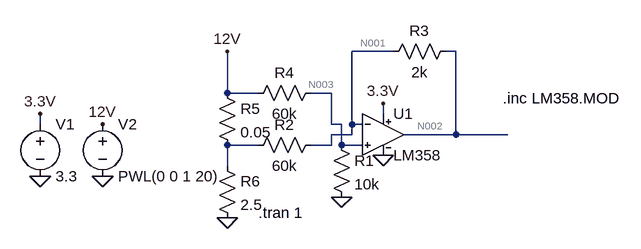
[diagram p0: schematic CurrentSense.asc]
CurrentSense.asc, the LTspice schematic file:
Version 4
SHEET 1 880 680
WIRE 240 48 176 48
WIRE 336 48 320 48
WIRE -16 112 -16 48
WIRE 32 112 -16 112
WIRE 144 112 112 112
WIRE 224 144 224 128
WIRE -304 160 -304 144
WIRE 144 160 144 112
WIRE 160 160 144 160
WIRE 176 160 176 48
WIRE 192 160 176 160
WIRE 176 176 176 160
WIRE 176 176 144 176
WIRE 336 176 336 48
WIRE 336 176 256 176
WIRE 416 176 336 176
WIRE 32 192 -16 192
WIRE 144 192 144 176
WIRE 144 192 112 192
WIRE 160 192 160 160
WIRE 192 192 160 192
WIRE -16 224 -16 192
FLAG 224 208 0
FLAG -304 240 0
FLAG 224 128 3.3V
FLAG -304 144 3.3V
FLAG -16 304 0
FLAG -208 240 0
FLAG -208 160 12V
FLAG -16 48 12V
FLAG 160 272 0
SYMBOL res 336 32 R90
WINDOW 0 0 56 VBottom 2
WINDOW 3 32 56 VTop 2
SYMATTR InstName R3
SYMATTR Value 2k
SYMBOL LM358\\LM358 224 112 R0
SYMATTR InstName U1
SYMBOL voltage -304 144 R0
WINDOW 123 0 0 Left 2
WINDOW 39 0 0 Left 2
SYMATTR InstName V1
SYMATTR Value 3.3
SYMBOL res 128 96 R90
WINDOW 0 0 56 VBottom 2
WINDOW 3 32 56 VTop 2
SYMATTR InstName R4
SYMATTR Value 60k
SYMBOL res -32 96 R0
SYMATTR InstName R5
SYMATTR Value 0.05
SYMBOL res -32 208 R0
SYMATTR InstName R6
SYMATTR Value 2.5
SYMBOL voltage -208 144 R0
WINDOW 123 0 0 Left 2
WINDOW 39 0 0 Left 2
SYMATTR InstName V2
SYMATTR Value PWL(0 0 1 20)
SYMBOL res 144 176 R0
SYMATTR InstName R1
SYMATTR Value 10k
SYMBOL res 128 176 R90
WINDOW 0 0 56 VBottom 2
WINDOW 3 32 56 VTop 2
SYMATTR InstName R2
SYMATTR Value 60k
TEXT 32 296 Left 2 !.tran 1
TEXT 408 120 Left 2 !.inc LM358.MOD

The netlist it stands for:
* CurrentSense.asc
R3 N002 N001 2k
XU1 N001 N003 N002 3.3V 0 LM358  ; pins In- In+ OUT V+ V-
V1 3.3V 0 3.3
R4 N003 12V 60k
R5 12V N004 0.05
R6 N004 0 2.5
V2 12V 0 PWL(0 0 1 20)
R1 N003 0 10k
R2 N001 N004 60k
.tran 1
.inc LM358.MOD
.lib LM358.MOD
.backanno
.end

* Results of the author's LTspice run, read from the files saved beside the schematic
* Operating Point, zero values left out:
*   V(n002) = 2.127 mV
*   V(n001) = 2.071 mV
*   V(n003) = 59.65 µV
*   V(3.3v) = 3.3 V
*   I(R2) = 34.51 nA
*   I(R1) = 5.965 nA
*   I(R6) = 676.7 pA
*   I(R5) = -33.83 nA
*   I(R4) = 994.1 pA
*   I(R3) = 27.97 nA
*   I(V2) = 34.83 nA
*   I(V1) = -230.4 µA
*   Ix(u1:1) = -6.543 nA
*   Ix(u1:2) = -6.959 nA
*   Ix(u1:3) = -27.97 nA
*   Ix(u1:4) = 230.4 µA
*   Ix(u1:5) = -230.4 µA
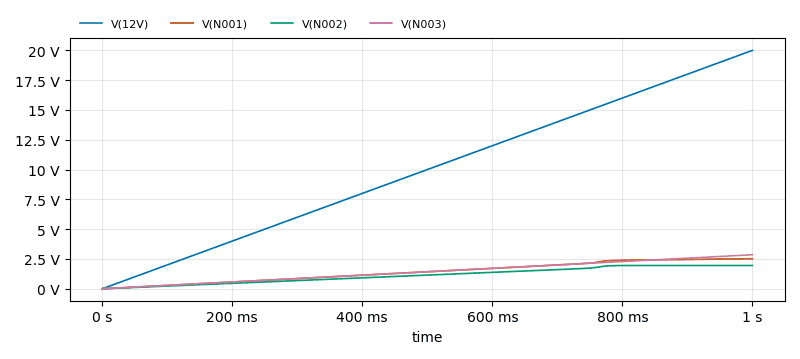
[diagram p1: Transient Analysis of CurrentSense.asc, plotted from the saved traces]
* Transient Analysis, 1 run:
*   V(12V): min 0 V, max 20 V, average 10 V, rms 11.73 V, last 20 V
*   V(N001): min 2.071 mV, max 2.524 V, average 1.411 V, rms 1.645 V, last 2.524 V
*   V(N002): min 2.127 mV, max 1.954 V, average 1.131 V, rms 1.317 V, last 1.954 V
*   V(N003): min 59.65 µV, max 2.857 V, average 1.429 V, rms 1.675 V, last 2.857 V